# Altium schematic sheet lvds_transceiver.SchDoc
size Letter; DocumentNumber: 4; SheetNumber: 4; SheetTotal: 6
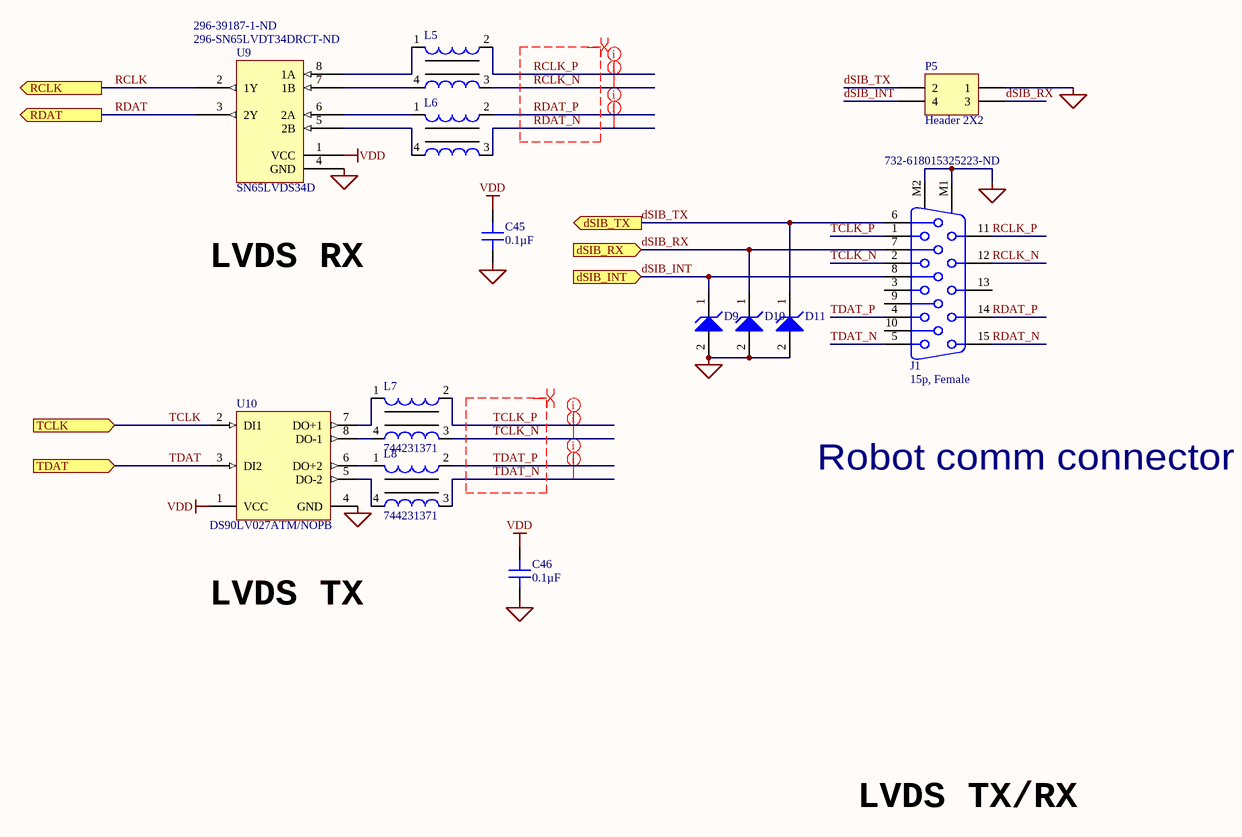
[diagram p0: lvds_transceiver.SchDoc]

## Parts
C45  0.1µF  [FP-GRM155-0_05-IPC_B]
C46  0.1µF  [FP-GRM155-0_05-IPC_B]
D9  ESD9L3.3ST5G  [ONSC-SOD-923-2-514AB-01_V]  (value not drawn)
D10  ESD9L3.3ST5G  [ONSC-SOD-923-2-514AB-01_V]  (value not drawn)
D11  ESD9L3.3ST5G  [ONSC-SOD-923-2-514AB-01_V]  (value not drawn)
J1  15p, Female  Supplier Part Number 1: 732-618015325223-ND  [618015325223]
L5  744231371  [WE-CNSW-0805]  (value not drawn)
L6  744231371  [WE-CNSW-0805]  (value not drawn)
L7  744231371  [WE-CNSW-0805]
L8  744231371  [WE-CNSW-0805]
P5  Header 2X2  [DF11-4DP-2DSA]
U9  SN65LVDS34D  Supplier Part Number 1: 296-SN65LVDT34DRCT-ND  Supplier Part Number 2: 296-39187-1-ND  [SOIC127P600X175-8N]
U10  DS90LV027ATM/NOPB  [D0008A_L]

## Ports
dSIB_INT (in), dSIB_RX (in), dSIB_TX (out), RCLK (out), RDAT (out), TCLK (in), TDAT (in)

## Nets
GND: C45.1 C46.1 D9.2(A) D10.2(A) D11.2(A) J1.M1 J1.M2 P5.1 U9.4(GND) U10.4(GND)
VDD: C45.2 C46.2 U9.1(VCC) U10.1(VCC)
dSIB_INT: D9.1(K) J1.8 P5.4 ; port dSIB_INT
dSIB_RX: D10.1(K) J1.7 P5.3 ; port dSIB_RX
dSIB_TX: D11.1(K) J1.6 P5.2 ; port dSIB_TX
RCLK: U9.2(1Y) ; port RCLK
RCLK_N: J1.12 L5.3
RCLK_P: J1.11 L5.2
RDAT: U9.3(2Y) ; port RDAT
RDAT_N: J1.15 L6.3
RDAT_P: J1.14 L6.2
TCLK: U10.2(DI1) ; port TCLK
TCLK_N: J1.2 L7.3
TCLK_P: J1.1 L7.2
TDAT: U10.3(DI2) ; port TDAT
TDAT_N: J1.5 L8.3
TDAT_P: J1.4 L8.2
NetL5_1: L5.1 U9.8(1A)
NetL5_4: L5.4 U9.7(1B)
NetL6_1: L6.1 U9.6(2A)
NetL6_4: L6.4 U9.5(2B)
NetL7_1: L7.1 U10.7(DO+1)
NetL7_4: L7.4 U10.8(DO-1)
NetL8_1: L8.1 U10.6(DO+2)
NetL8_4: L8.4 U10.5(DO-2)

Not connected (* = marked no-connect by the designer): J1 3 9 10 13

## Layout directives
net class 100ohm: RCLK_N, RCLK_P, RDAT_N, RDAT_P, TCLK_N, TCLK_P, TDAT_N, TDAT_P
differential pair: RCLK_N, RCLK_P, RDAT_N, RDAT_P, TCLK_N, TCLK_P, TDAT_N, TDAT_P

## Notes on the sheet
- LVDS RX
- Robot comm connector
- LVDS TX
- LVDS TX/RX

## Library data of the parts
C45 C46 = 04023C104KAT2A: CAP CER 0.1UF 25V X7R 0402; Manufacturer: AVX Corporation; Tolerance: ±10%; Value: 0.1µF; Part Number: 04023C104KAT2A; Applications: General Purpose; Capacitance: 0.1µF; ComponentLink1Description: Datasheet; ComponentLink1URL: http://datasheets.avx.com/X7RDielectric.pdf; ComponentLink2Description: DigiKey Link; ComponentLink2URL: http://digikey.com/product-detail/en/avx-corporation/04023C104KAT2A/478-7868-1-ND/3881491; Device Package: 0402 (1005 Metric); LastUpdated: 9/2/2020 1:02:21 AM; Lifecycle Status: Active; Minimum Order: 1; Mounting Type: Surface Mount, MLCC; Operating Temperature: -55°C ~ 125°C; Package / Case: 0402 (1005 Metric); Packaging: CutTape; PartId: 3190; Part Status: Active; Price: 0.13; Series: -; Size / Dimension: 0.039" L x 0.020" W (1.00mm x 0.50mm); Supplier 1: DigiKey; Supplier Part Number 1: 478-7868-1-ND; Temperature Coefficient: X7R; Thickness (Max): 0.022" (0.55mm); Voltage - Rated: 25V
D9-D11 = CMP-1063-00113-1: Transient Voltage Suppressor, ESD Protection Diode with Ultra-Low Capacitance, 2-Pin SOD-923, Pb-Free, Tape and Reel; Manufacturer: On Semiconductor; VRWM Max (V): 3.3; V(BR) Min (V): 4.8; Number of Lines: 1; Direction: Unidirectional; C Max (pF): 0.9; ComponentLink1URL: http://www.onsemi.com/; ComponentLink3Description: Package Specification; ComponentLink1Description: Manufacturer URL; DatasheetVersion: Rev. 5; ComponentLink2URL: http://www.onsemi.cn/pub_link/Collateral/ESD9L-D.PDF; RoHS: Pb-Free; ComponentLink3URL: http://www.onsemi.com/pub_link/Collateral/514AB.PDF; ComponentLink2Description: Datasheet; Mounting Technology: Surface Mount; PackageReference: SOD-923-2-514AB-01; Packing: Tape and Reel; PartNumber: ESD9L3.3ST5G; PackageDescription: 2-Pin SOD, Body 0.8 x 0.6 mm; IR Max (uA): 1; PackageVersion: Rev. C, 03/2011
J1 = 618015325223: WR-DSUB Female High Density Angled PCB Connector without Hex Screw, 15p; Manufacturer: Wurth Electronics; PinNumber: 15; Published: June 2016; Publisher: Wurth Elektronik; ComponentLink1Description: Manufacturer; ComponentLink1URL: http://www.we-online.de; ComponentLink2Description: Datasheet; ComponentLink2URL: http://katalog.we-online.de/em/datasheet/6180xx325223.pdf; PartNumber: 618015325223; Supplier 1: Digi-Key; Manufacturer Part Number: 618015325223; RoHS: Yes; Category: D-Sub Connectors; Stock 1: 157; Pricing 1: 1=4.02000, 10=3.81000, 50=3.38400, 100=2.95200, 250=2.53200, 500=2.25600 (USD); RoHS Compliant: Yes
L5-L8 = CMP-0222-00042-1: SMD Common Mode Noise Suppressor WE-CNSW, Z = 370 Ohm; Impedance: 370 Ohm; ComponentLink2URL: http://www.we-online.de/katalog/media/pdf/744231371.pdf; ComponentLink1Description: Manufacturer Link; PackageReference: WE-CNSW-0805; PackageDescription: SMD Inductor, 4-Leads, Body 1.4 x 2.2 mm; ComponentLink2Description: Datasheet; DatasheetVersion: ver 4, Nov-2010; ComponentLink1URL: http://www.we-online.com; PackageVersion: 2010
P5 = Header 2X2: Header, 2-Pin, Dual row; LatestRevisionDate: 17-Jul-2002; LatestRevisionNote: Re-released for DXP Platform.; Publisher: Altium Limited
U9 = SN65LVDS34D: LVDS Receiver 8-Pin SOIC T/R; Manufacturer: Texas Instruments; Manufacturer Part Number: SN65LVDS34DR; Number of Receivers: 4; Operating Supply Voltage: 3.3V; Propagation Delay: 9ns; Max Power Dissipation: 950mW; Nominal Supply Current: 12mA; Max Supply Voltage: 3.6V; Min Supply Voltage: 3V; Data Rate: 400Mbps; Receiver Hysteresis: 50mV; Max Input Current: 75uA; Stock 1: 3654; Pricing 1: 1=2.27, 10=2.042, 100=1.641, 500=1.34828, 1000=1.11714 (USD); Mount: Surface Mount; Case/Package: SOIC; Number of Pins: 8; Weight: 0.002561oz; Contact Plating: Gold; Min Operating Temperature: -40°C; Max Operating Temperature: 85°C; Packaging: Tape and Reel; Package Quantity: 2500; Number of Elements: 4; Number of Drivers: 4; Turn-On Delay Time: 9ns; Power Dissipation: 950mW; Logic Function: Receiver; Lead Free: Lead Free; ComponentLink1URL: https://datasheet.ciiva.com/1770/sn65lvdt33-1770664.pdf; ComponentLink1Description: https://datasheet.ciiva.com/1770/sn65lvdt33-1770664.pdf; ComponentLink2URL: https://datasheet.ciiva.com/3152/sn65lvds33-3152872.pdf; ComponentLink2Description: https://datasheet.ciiva.com/3152/sn65lvds33-3152872.pdf; RoHS: Yes; Category: Interface ICs; Stock 2: 2291; Pricing 2: 1=2.75000, 10=2.47200, 25=2.33200, 100=1.86560, 250=1.63240, 500=1.58576, 1000=1.25928 (USD); Series: 65LVDT; Supply Current: 12mA; Radiation Hardening: No; RoHS Compliant: Yes; ComponentLink3URL: https://datasheet.ciiva.com/15133/getdatasheetpartid-524946-15133570.pdf?src-supplier=Verical; ComponentLink3Description: https://datasheet.ciiva.com/15133/getdatasheetpartid-524946-15133570.pdf?src-supplier=Verical; ComponentLink4URL: https://datasheet.ciiva.com/26828/sn65lvdt34dr-26828764.pdf?src-supplier=IIIC; ComponentLink4Description: https://datasheet.ciiva.com/26828/sn65lvdt34dr-26828764.pdf?src-supplier=IIIC; ComponentLink5URL: https://datasheet.ciiva.com/1770/sn65lvdt33-1770866.pdf?src-supplier=Digi-Key; ComponentLink5Description: https://datasheet.ciiva.com/1770/sn65lvdt33-1770866.pdf?src-supplier=Digi-Key; ComponentLink6URL: https://datasheet.ciiva.com/3153/sn65lvds33-3153018.pdf?src-supplier=Avnet; ComponentLink6Description: https://datasheet.ciiva.com/3153/sn65lvds33-3153018.pdf?src-supplier=Avnet; ComponentLink7URL: https://datasheet.ciiva.com/26002/slls490b-26002508.pdf?src-supplier=Avnet+Europe; ComponentLink7Description: https://datasheet.ciiva.com/26002/slls490b-26002508.pdf?src-supplier=Avnet+Europe; Supplier 1: Digi-Key; Supplier 2: Digi-Key
U10 = CMP-0058-00996-3: LVDS Dual High Speed Differential Driver, 8-pin Narrow SOIC, Pb-Free; Manufacturer: Texas Instruments; PowerWise: N; CompType: Interface IC; PackageTopMarking: NSZXTT*LV27A*TM; ComponentLink1Description: Datasheet URL; Code_JEDEC: MS-012-AA; PinCount: 8; PackageDescription: SOIC Narrow, 4.9 x 3.9 x 1.45mm, 8 Lead, 1.27mm Pitch; RoHS: Y; ComponentLink1URL: http://www.ti.com/general/docs/lit/getliterature.tsp?genericPartNumber=DS90LV027A&fileType=pdf; PackageReference: D0008A; Code_IPC: SOIC127P600-8